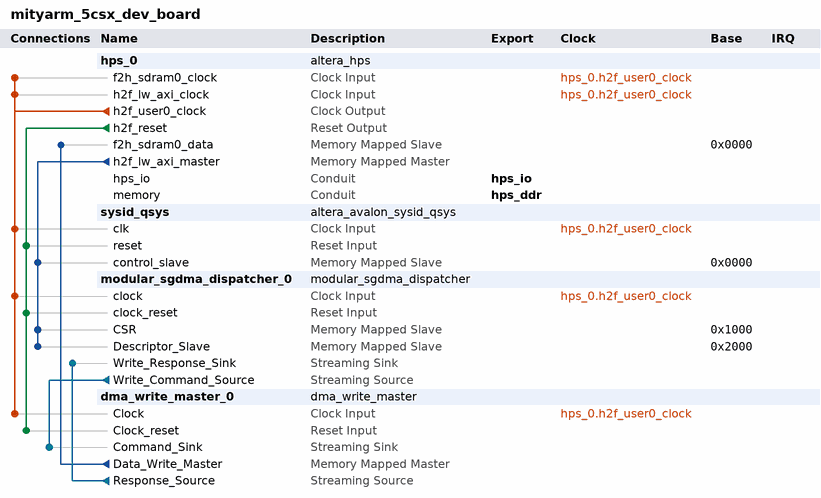
[diagram p0: system contents]
# Platform Designer (Qsys) system mityarm_5csx_dev_board, Cyclone V 5CSXFC6C6U23C8ES
# Parameters at their usual value, and those the tool derives, are not listed.
package require -exact qsys 13.1
create_system mityarm_5csx_dev_board
set_project_property DEVICE_FAMILY {Cyclone V}
set_project_property DEVICE 5CSXFC6C6U23C8ES

add_instance hps_0 altera_hps 13.1
set_instance_parameter_value hps_0 MEM_VENDOR JEDEC
set_instance_parameter_value hps_0 MEM_ROW_ADDR_WIDTH 15
set_instance_parameter_value hps_0 MEM_COL_ADDR_WIDTH 10
set_instance_parameter_value hps_0 MEM_DQ_WIDTH 40
set_instance_parameter_value hps_0 MEM_BANKADDR_WIDTH 3
set_instance_parameter_value hps_0 MEM_DRV_STR RZQ/7
set_instance_parameter_value hps_0 MEM_RTT_NOM {ODT Disabled}
set_instance_parameter_value hps_0 MEM_RTT_WR RZQ/4
set_instance_parameter_value hps_0 MEM_WTCL 6
set_instance_parameter_value hps_0 MEM_TCL 7
set_instance_parameter_value hps_0 TIMING_TIS 170
set_instance_parameter_value hps_0 TIMING_TIH 120
set_instance_parameter_value hps_0 TIMING_TDS 10
set_instance_parameter_value hps_0 TIMING_TDH 45
set_instance_parameter_value hps_0 TIMING_TDQSQ 100
set_instance_parameter_value hps_0 TIMING_TDQSCK 225
set_instance_parameter_value hps_0 TIMING_TDQSS 0.27
set_instance_parameter_value hps_0 TIMING_TQSH 0.4
set_instance_parameter_value hps_0 TIMING_TDSH 0.18
set_instance_parameter_value hps_0 TIMING_TDSS 0.18
set_instance_parameter_value hps_0 MEM_TRAS_NS 35.0
set_instance_parameter_value hps_0 MEM_TRCD_NS 13.75
set_instance_parameter_value hps_0 MEM_TRP_NS 13.75
set_instance_parameter_value hps_0 MEM_TRFC_NS 260.0
set_instance_parameter_value hps_0 MEM_TFAW_NS 30.0
set_instance_parameter_value hps_0 MEM_TRRD_NS 10.0
set_instance_parameter_value hps_0 MEM_TRTP_NS 10.0
set_instance_parameter_value hps_0 REF_CLK_FREQ 25.0
set_instance_parameter_value hps_0 DEFAULT_FAST_SIM_MODEL true
set_instance_parameter_value hps_0 MEM_VOLTAGE {1.35V DDR3L}
set_instance_parameter_value hps_0 TIMING_BOARD_MAX_CK_DELAY 0.6
set_instance_parameter_value hps_0 TIMING_BOARD_MAX_DQS_DELAY 0.2
set_instance_parameter_value hps_0 TIMING_BOARD_SKEW_CKDQS_DIMM_MIN 0.092
set_instance_parameter_value hps_0 TIMING_BOARD_SKEW_CKDQS_DIMM_MAX 0.215
set_instance_parameter_value hps_0 TIMING_BOARD_SKEW_WITHIN_DQS 0.0
set_instance_parameter_value hps_0 TIMING_BOARD_SKEW_BETWEEN_DQS 0.01
set_instance_parameter_value hps_0 TIMING_BOARD_DQ_TO_DQS_SKEW 0.0
set_instance_parameter_value hps_0 TIMING_BOARD_AC_SKEW 0.0
set_instance_parameter_value hps_0 TIMING_BOARD_AC_TO_CK_SKEW 0.0
set_instance_parameter_value hps_0 MEM_CLK_FREQ 400.0
set_instance_parameter_value hps_0 HPS_PROTOCOL DDR3
set_instance_parameter_value hps_0 STM_Enable false
set_instance_parameter_value hps_0 F2S_Width 0
set_instance_parameter_value hps_0 S2F_Width 0
set_instance_parameter_value hps_0 LWH2F_Enable true
set_instance_parameter_value hps_0 F2SDRAM_Type {Avalon-MM Write-Only}
set_instance_parameter_value hps_0 F2SDRAM_Width 64
set_instance_parameter_value hps_0 F2SCLK_DBGRST_Enable false
set_instance_parameter_value hps_0 F2SCLK_WARMRST_Enable false
set_instance_parameter_value hps_0 F2SCLK_COLDRST_Enable false
set_instance_parameter_value hps_0 F2SINTERRUPT_Enable true
set_instance_parameter_value hps_0 EMAC1_PinMuxing {HPS I/O Set 0}
set_instance_parameter_value hps_0 EMAC1_Mode RGMII
set_instance_parameter_value hps_0 QSPI_PinMuxing {HPS I/O Set 1}
set_instance_parameter_value hps_0 QSPI_Mode {2 SS}
set_instance_parameter_value hps_0 SDIO_PinMuxing {HPS I/O Set 0}
set_instance_parameter_value hps_0 SDIO_Mode {4-bit Data}
set_instance_parameter_value hps_0 USB1_PinMuxing {HPS I/O Set 0}
set_instance_parameter_value hps_0 USB1_Mode SDR
set_instance_parameter_value hps_0 SPIM1_PinMuxing Unused
set_instance_parameter_value hps_0 SPIM1_Mode N/A
set_instance_parameter_value hps_0 UART0_PinMuxing {HPS I/O Set 2}
set_instance_parameter_value hps_0 UART0_Mode {No Flow Control}
set_instance_parameter_value hps_0 I2C0_PinMuxing {HPS I/O Set 1}
set_instance_parameter_value hps_0 I2C0_Mode I2C
set_instance_parameter_value hps_0 I2C1_PinMuxing {HPS I/O Set 0}
set_instance_parameter_value hps_0 I2C1_Mode I2C
set_instance_parameter_value hps_0 CAN0_PinMuxing {HPS I/O Set 0}
set_instance_parameter_value hps_0 CAN0_Mode CAN
set_instance_parameter_value hps_0 CAN1_PinMuxing {HPS I/O Set 1}
set_instance_parameter_value hps_0 CAN1_Mode CAN
set_instance_parameter_value hps_0 S2FCLK_USER0CLK_Enable true
set_instance_parameter_value hps_0 S2FCLK_USER1CLK_FREQ 100
set_instance_parameter_value hps_0 FPGA_PERIPHERAL_OUTPUT_CLOCK_FREQ_EMAC0_MD_CLK 100
set_instance_parameter_value hps_0 FPGA_PERIPHERAL_OUTPUT_CLOCK_FREQ_EMAC0_GTX_CLK 100
set_instance_parameter_value hps_0 FPGA_PERIPHERAL_OUTPUT_CLOCK_FREQ_EMAC1_MD_CLK 100
set_instance_parameter_value hps_0 FPGA_PERIPHERAL_OUTPUT_CLOCK_FREQ_EMAC1_GTX_CLK 100

add_instance sysid_qsys altera_avalon_sysid_qsys 13.1
set_instance_parameter_value sysid_qsys id 1

add_instance modular_sgdma_dispatcher_0 modular_sgdma_dispatcher 1.0
set_instance_parameter_value modular_sgdma_dispatcher_0 MODE 2
set_instance_parameter_value modular_sgdma_dispatcher_0 GUI_RESPONSE_PORT 2
set_instance_parameter_value modular_sgdma_dispatcher_0 DESCRIPTOR_FIFO_DEPTH 8
set_instance_parameter_value modular_sgdma_dispatcher_0 ENHANCED_FEATURES 0
set_instance_parameter_value modular_sgdma_dispatcher_0 CSR_ADDRESS_WIDTH 3

add_instance dma_write_master_0 dma_write_master 1.0
set_instance_parameter_value dma_write_master_0 DATA_WIDTH 64
set_instance_parameter_value dma_write_master_0 LENGTH_WIDTH 32
set_instance_parameter_value dma_write_master_0 FIFO_DEPTH 128
set_instance_parameter_value dma_write_master_0 STRIDE_ENABLE 0
set_instance_parameter_value dma_write_master_0 GUI_STRIDE_WIDTH 1
set_instance_parameter_value dma_write_master_0 BURST_ENABLE 1
set_instance_parameter_value dma_write_master_0 GUI_MAX_BURST_COUNT 32
set_instance_parameter_value dma_write_master_0 GUI_PROGRAMMABLE_BURST_ENABLE 0
set_instance_parameter_value dma_write_master_0 GUI_BURST_WRAPPING_SUPPORT 0
set_instance_parameter_value dma_write_master_0 TRANSFER_TYPE {Aligned Accesses}
set_instance_parameter_value dma_write_master_0 PACKET_ENABLE 1
set_instance_parameter_value dma_write_master_0 ERROR_ENABLE 0
set_instance_parameter_value dma_write_master_0 ERROR_WIDTH 8
set_instance_parameter_value dma_write_master_0 ADDRESS_WIDTH 32
set_instance_parameter_value dma_write_master_0 FIFO_SPEED_OPTIMIZATION 1

# connections
add_connection hps_0.h2f_user0_clock dma_write_master_0.Clock clock
add_connection hps_0.h2f_user0_clock hps_0.f2h_sdram0_clock clock
add_connection hps_0.h2f_user0_clock hps_0.h2f_lw_axi_clock clock
add_connection hps_0.h2f_user0_clock modular_sgdma_dispatcher_0.clock clock
add_connection hps_0.h2f_user0_clock sysid_qsys.clk clock
add_connection hps_0.h2f_reset dma_write_master_0.Clock_reset reset
add_connection hps_0.h2f_reset modular_sgdma_dispatcher_0.clock_reset reset
add_connection hps_0.h2f_reset sysid_qsys.reset reset
add_connection dma_write_master_0.Data_Write_Master hps_0.f2h_sdram0_data avalon
set_connection_parameter_value dma_write_master_0.Data_Write_Master/hps_0.f2h_sdram0_data baseAddress 0x0000
add_connection hps_0.h2f_lw_axi_master modular_sgdma_dispatcher_0.CSR avalon
set_connection_parameter_value hps_0.h2f_lw_axi_master/modular_sgdma_dispatcher_0.CSR baseAddress 0x1000
add_connection hps_0.h2f_lw_axi_master modular_sgdma_dispatcher_0.Descriptor_Slave avalon
set_connection_parameter_value hps_0.h2f_lw_axi_master/modular_sgdma_dispatcher_0.Descriptor_Slave baseAddress 0x2000
add_connection hps_0.h2f_lw_axi_master sysid_qsys.control_slave avalon
set_connection_parameter_value hps_0.h2f_lw_axi_master/sysid_qsys.control_slave baseAddress 0x0000
add_connection dma_write_master_0.Response_Source modular_sgdma_dispatcher_0.Write_Response_Sink avalon_streaming
add_connection modular_sgdma_dispatcher_0.Write_Command_Source dma_write_master_0.Command_Sink avalon_streaming

# exported interfaces
add_interface hps_ddr conduit end
set_interface_property hps_ddr EXPORT_OF hps_0.memory
add_interface hps_io conduit end
set_interface_property hps_io EXPORT_OF hps_0.hps_io

set_interconnect_requirement {$system} qsys_mm.clockCrossingAdapter HANDSHAKE
set_interconnect_requirement {$system} qsys_mm.maxAdditionalLatency 1

save_system mityarm_5csx_dev_board.qsys
